# EAGLE design avr_g1000_ctr_24 (EAGLE 9.4.0)
using PC6 as IO Pin requires RSTDSbl Fuse to be set added C2 rmvd AREF swapped PC3, PC6, PD4 08 mirror and totate USB connectors additional FPC ZIF connector abandoned, insufficient real estate
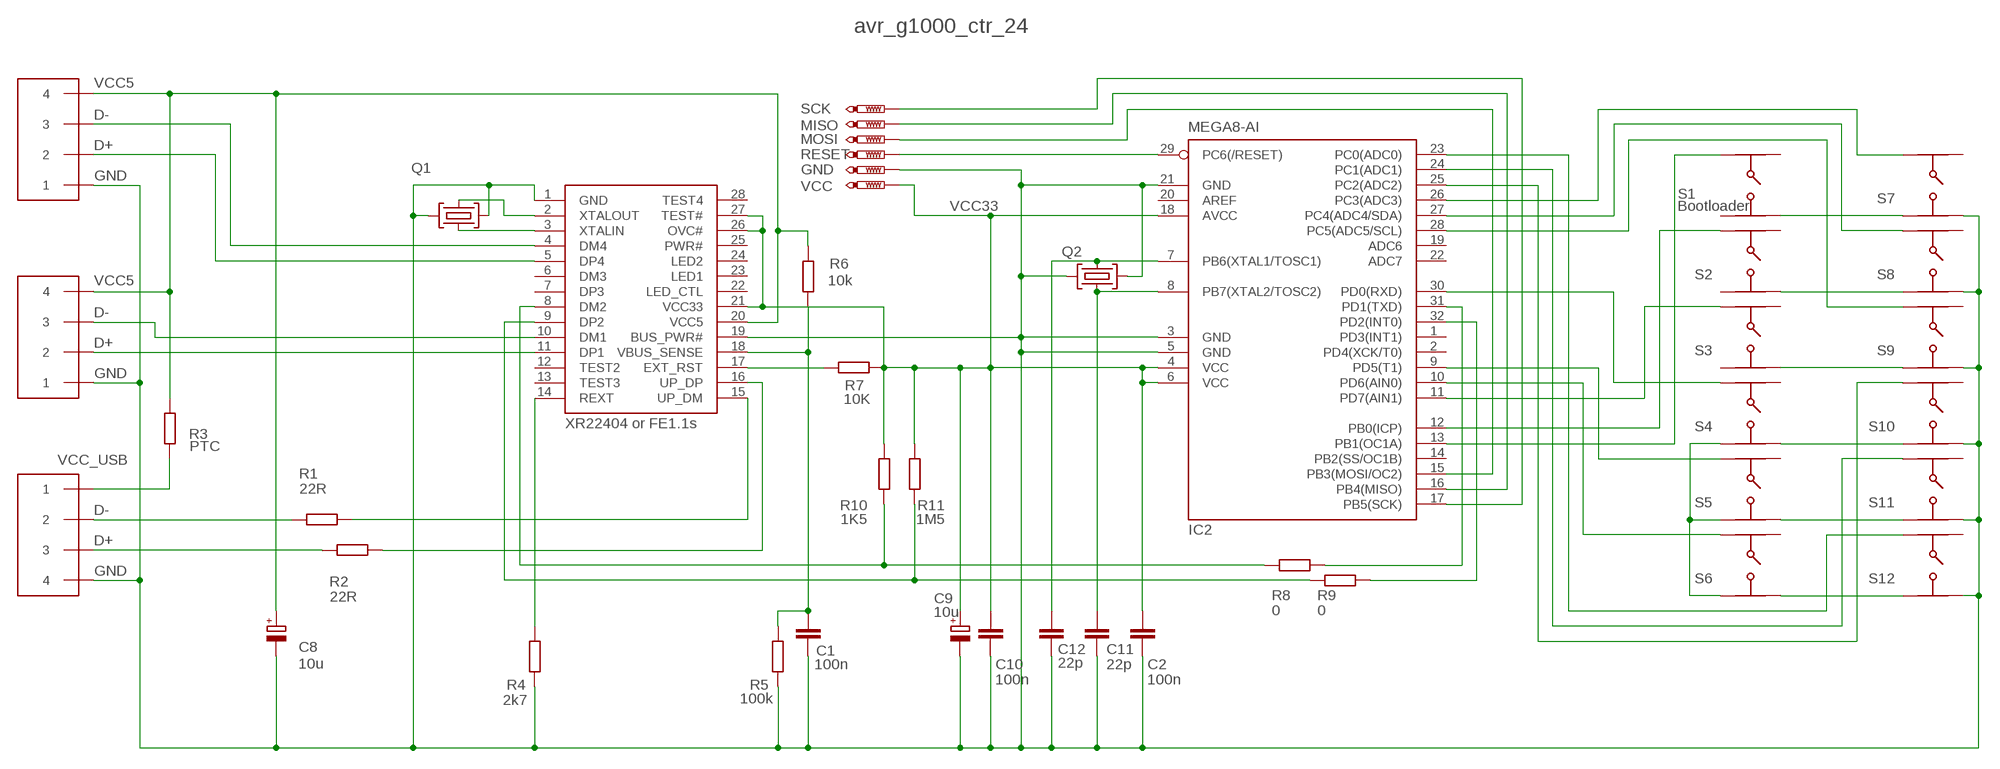
[diagram p0: schematic, sheet 1]

## Parts
C1  100n  C-EUC0402  [C0402]
C2  100n  C-EUC0402  [C0402]
C8  10u  CPOL-EUSMCA  [SMC_A]
C9  10u  CPOL-EUSMCA  [SMC_A]
C10  100n  C-EUC0402  [C0402]
C11  22p  C-EUC0402  [C0402]
C12  22p  C-EUC0402  [C0402]
GND  PTR1TP10R  [TP10R]
IC2  MEGA8-AI  [TQFP32-08]
MISO  PTR1TP10R  [TP10R]
MOSI  PTR1TP10R  [TP10R]
Q1  12MHz  MJ-CRYSTALMJ  [OSCCC500X320X100]
Q2  12Mhz  MJ-CRYSTALMJ  [OSCCC500X320X100]
R1  22R  R-EU_R0603  [R0603]
R2  22R  R-EU_R0603  [R0603]
R3  PTC  R-EU_R0805  [R0805]
R4  2k7  R-EU_R0603  [R0603]
R5  100k  R-EU_R0603  [R0603]
R6  10k  R-EU_R0603  [R0603]
R7  10K  R-EU_R0603  [R0603]
R8  0  R-EU_R0603  [R0603]
R9  0  R-EU_R0603  [R0603]
R10  1K5  R-EU_R0603  [R0603]
R11  1M5  R-EU_R0603  [R0603]
RESET  PTR1TP10R  [TP10R]
S1  B3FS1000  [B3FS1000]
S2  B3FS1000  [B3FS1000]
S3  B3FS1000  [B3FS1000]
S4  B3FS1000  [B3FS1000]
S5  B3FS1000  [B3FS1000]
S6  B3FS1000  [B3FS1000]
S7  B3FS1000  [B3FS1000]
S8  B3FS1000  [B3FS1000]
S9  B3FS1000  [B3FS1000]
S10  B3FS1000  [B3FS1000]
S11  B3FS1000  [B3FS1000]
S12  B3FS1000  [B3FS1000]
SCK  PTR1TP10R  [TP10R]
U$1  HEADER4X1.27  [HEADER4X1.27]
U$2  HEADER4X1.27  [HEADER4X1.27]
U$3  HEADER4X1.27  [HEADER4X1.27]
VCC  PTR1TP10R  [TP10R]
XR22404  XR22404  [XR22404]

## Nets
D+: R2.1 U$1.P3
D-: R1.1 U$1.P2
DM1: U$2.P3 XR22404.10(DM1)
DM2: R8.1 R10.1 XR22404.8(DM2)
DM4: U$3.P3 XR22404.4(DM4)
DP1: U$2.P2 XR22404.11(DP1)
DP2: R9.1 R11.1 XR22404.9(DP2)
DP4: U$3.P2 XR22404.5(DP4)
EXT_RST: R7.1 XR22404.17(EXT_RST)
GND [GND]: C1.2 C2.2 C8.- C9.- C10.2 C11.2 C12.2 GND.TP IC2.3(GND) IC2.5(GND) IC2.21(GND) Q1.2(GND1) Q1.4(GND2) Q2.2(GND1) Q2.4(GND2) R4.1 R5.1 S1.1 S2.1 S3.1 S4.1 S4.2 S5.1 S5.2 S6.1 S6.2 S7.1 S7.2 S8.1 S8.2 S9.1 S9.2 S10.1 S10.2 S11.1 S11.2 S12.1 S12.2 U$1.P4 U$2.P1 U$3.P1 XR22404.1(GND) XR22404.19(BUS_PWR#)
MISO: IC2.16(PB4(MISO)) MISO.TP
MOSI: IC2.15(PB3(MOSI/OC2)) MOSI.TP
PB0: IC2.12(PB0(ICP)) S2.4
PB1: IC2.13(PB1(OC1A)) S1.4
PC0: IC2.23(PC0(ADC0)) S12.4
PC1: IC2.24(PC1(ADC1)) S11.4
PC2: IC2.25(PC2(ADC2)) S10.4
PC3: IC2.26(PC3(ADC3)) S7.4
PC4: IC2.27(PC4(ADC4/SDA)) S8.4
PC5: IC2.28(PC5(ADC5/SCL)) S9.4
PD0: IC2.30(PD0(RXD)) S4.4
PD1: IC2.31(PD1(TXD)) R8.2
PD2: IC2.32(PD2(INT0)) R9.2
PD5: IC2.9(PD5(T1)) S5.4
PD6: IC2.10(PD6(AIN0)) S6.4
PD7: IC2.11(PD7(AIN1)) S3.4
RESET: IC2.29(PC6(/RESET)) RESET.TP
REXT: R4.2 XR22404.14(REXT)
SCK: IC2.17(PB5(SCK)) SCK.TP
UP_DM: R1.2 XR22404.15(UP_DM)
UP_DP: R2.2 XR22404.16(UP_DP)
VBUS_SENSE: C1.1 R5.2 R6.1 XR22404.18(VBUS_SENSE)
VCC5: C8.+ R3.2 R6.2 U$2.P4 U$3.P4 XR22404.20(VCC5)
VCC33: C2.1 C9.+ C10.1 IC2.4(VCC) IC2.6(VCC) IC2.18(AVCC) R7.2 R10.2 R11.2 VCC.TP XR22404.21(VCC33) XR22404.26(OVC#) XR22404.27(TEST#)
VCC_USB: R3.1 U$1.P1
XTAL1: C12.1 IC2.7(PB6(XTAL1/TOSC1)) Q2.1(CRYSTAL1)
XTAL2: C11.1 IC2.8(PB7(XTAL2/TOSC2)) Q2.3(CRYSTAL2)
XTALIN: Q1.3(CRYSTAL2) XR22404.3(XTALIN)
XTALOUT: Q1.1(CRYSTAL1) XR22404.2(XTALOUT)
Unconnected: IC2.1(PD3(INT1)) IC2.2(PD4(XCK/T0)) IC2.14(PB2(SS/OC1B)) IC2.19(ADC6) IC2.20(AREF) IC2.22(ADC7) S1.2 S1.3 S2.2 S2.3 S3.2 S3.3 S4.3 S5.3 S6.3 S7.3 S8.3 S9.3 S10.3 S11.3 S12.3 XR22404.6(DM3) XR22404.7(DP3) XR22404.12(TEST2) XR22404.13(TEST3) XR22404.22(LED_CTL) XR22404.23(LED1) XR22404.24(LED2) XR22404.25(PWR#) XR22404.28(TEST4)

## Notes on the sheet
- avr_g1000_ctr_24
- Bootloader
- XR22404 or FE1.1s

## Library data of the parts
C1 C2 C10-C12 = rcl:C-EU: CAPACITOR, European symbol; SPICEPREFIX: C
C8 C9 = rcl:CPOL-EU: POLARIZED CAPACITOR, European symbol; SPICEPREFIX: C
GND MISO MOSI RESET SCK VCC = testpad:PTR1: TEST PIN
IC2 = atmel:MEGA8: MICROCONTROLLER 8 Kbytes FLASH, 1 kbytes SRAM, 512 bytes EEPROM, USART, 6-channel 10 bit ADC, 2-channel 8 bit ADC Pin compatible with Atmega48, ATMega88, ATMega168 Source: avr.lbr; MPN: ATMEGA8-16AU; OC_FARNELL: 9171371; OC_NEWARK: 73M8863
Q1 Q2 = euroquartz:MJ-CRYSTAL: Miniature size: 5.0mm x 3.2mm x 1.0mm height
R1-R11 = rcl:R-EU_: RESISTOR, European symbol; SPICEPREFIX: R
S1-S12 = omron b3fs1000:B3FS1000
U$1-U$3 = header4x1.27:HEADER4X1.27
XR22404 = xr22404:XR22404

## Net classes
0 default: width 0.15 mm, clearance 0.15 mm
1 GND: width 0.3 mm, clearance 0.15 mm to class 0, clearance 0.15 mm
2 VCC: width 0.3 mm, clearance 0.15 mm to class 0, clearance 0.15 mm to class 1, clearance 0.15 mm

## Board
chgd all 22p and 100n to 0402 v6 dimension filet placement drills and measures v7 position USB conn 08 corrct dimension, realign USB connectors 09 optimizations for case test verify electronic v20 added USB serial and pullup resistors, USB hub ports WIP rearranged S7-12 to avoid use of PC6 v21 testpoints part names cleanup reroute VC33 for RESET pin inlining DRC ok v22 replace tact switches, drill 2mm DRC ok v24 Testpins d 1mm, pitch 1.27 DRC ok
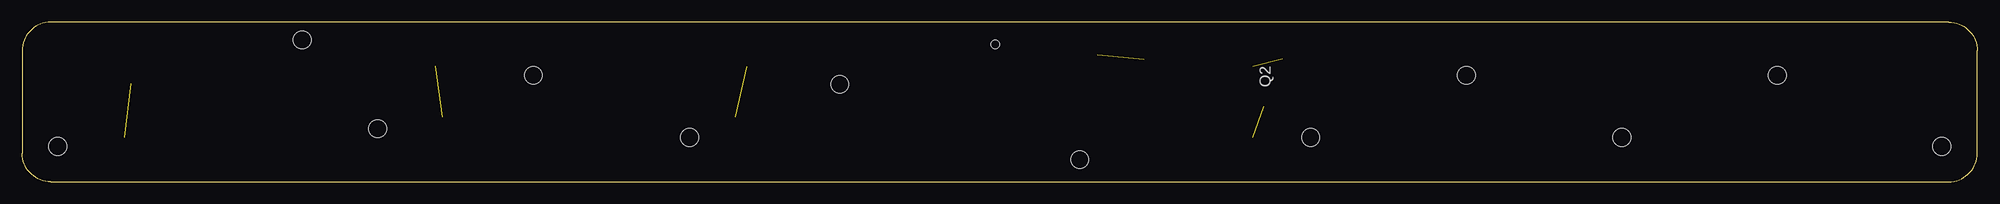
[diagram p1: board, top side]
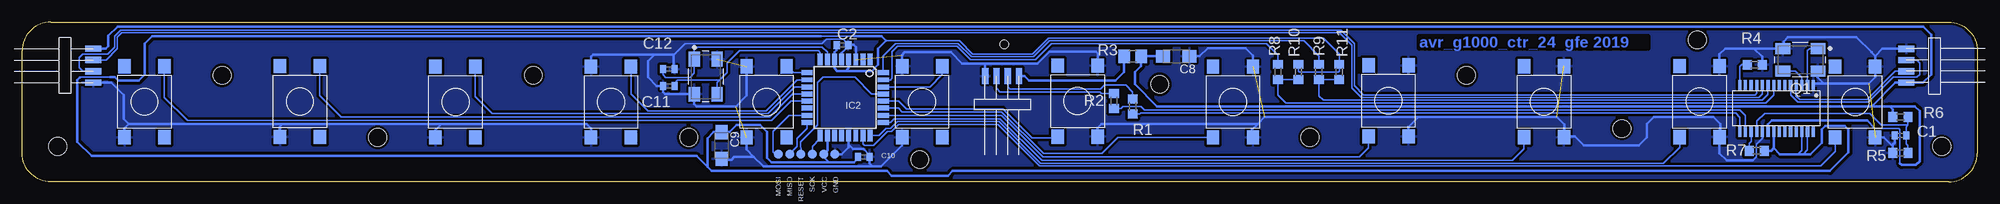
[diagram p2: board, bottom side, seen from below]

Size 220 x 18 mm. Coordinates in mm from the lower left corner, seen from the top.
Outline: 3.2,0 216.8,0 arc90 220,3.2 220,14.8 arc90 216.8,18 3.2,18 arc90 0,14.8 0,3.2 arc90 3.2,0
Copper layers (1*16): Top 0.035mm / dielectric 1.5mm / Bottom 0.035mm
Design rules "default *": minimum track width 6mil, minimum drill 0.35mm, track to track 6mil, track to pad 6mil, pad to pad 6mil, via to via 6mil, smd to smd 6mil, copper to edge 12mil, drill to drill 6mil, minimum pad ring 10mil, minimum via ring 8mil, stop-mask expansion 4mil, vias tented up to drill 0mil, thermal gap 10mil
Holes 2 mm at 92,11 145,5 162.5,12 180,5 197.5,12 216,4 4,4 75.1,5 57.5,12 40,6 31.5,16 119,2.5
Holes 1 mm at 109.5,15.5

### Footprints (pad centres in the part's own frame; a part is rotated, then mirrored left to right if it is on the bottom)
C0402 = smd 0.7 x 0.9: 1 -0.65,0; 2 0.65,0
SMC_A = smd 1.6 x 1.4: + -1.5,0; - 1.5,0
TP10R = smd 1 x 1: TP 0,0
TQFP32-08 = smd 1.27 x 0.559: 1 -4.293,2.8; 2 -4.293,2; 3 -4.293,1.2; 4 -4.293,0.4; 5 -4.293,-0.4; 6 -4.293,-1.2; 7 -4.293,-2; 8 -4.293,-2.8; 17 4.293,-2.8; 18 4.293,-2; 19 4.293,-1.2; 20 4.293,-0.4; 21 4.293,0.4; 22 4.293,1.2; 23 4.293,2; 24 4.293,2.8 | smd 0.559 x 1.27: 9 -2.8,-4.293; 10 -2,-4.293; 11 -1.2,-4.293; 12 -0.4,-4.293; 13 0.4,-4.293; 14 1.2,-4.293; 15 2,-4.293; 16 2.8,-4.293; 25 2.8,4.293; 26 2,4.293; 27 1.2,4.293; 28 0.4,4.293; 29 -0.4,4.293; 30 -1.2,4.293; 31 -2,4.293; 32 -2.8,4.293
OSCCC500X320X100 = smd 1.662 x 1.262: 1 -1.975,-1.275; 2 1.975,-1.275; 3 1.975,1.275; 4 -1.975,1.275
R0603 = smd 1 x 1.1: 1 -0.85,0; 2 0.85,0
R0805 = smd 1.3 x 1.5: 1 -0.95,0; 2 0.95,0
B3FS1000 = smd 1.6 x 1.4: 1 -4,2.25; 2 4,2.25; 3 -4,-2.25; 4 4,-2.25
HEADER4X1.27 = smd 1.803 x 0.711: P1 0,0; P2 0,1.27; P3 0,2.54; P4 0,3.81
XR22404 = smd 0.356 x 1.27: 1 -3.785,-2.502; 2 -3.15,-2.502; 3 -2.515,-2.502; 4 -1.88,-2.502; 5 -1.245,-2.502; 6 -0.61,-2.502; 7 0.025,-2.502; 8 0.66,-2.502; 9 1.295,-2.502; 10 1.93,-2.502; 11 2.565,-2.502; 12 3.2,-2.502; 13 3.835,-2.502; 14 4.47,-2.502; 15 4.47,2.68; 16 3.835,2.68; 17 3.2,2.68; 18 2.565,2.68; 19 1.93,2.68; 20 1.295,2.68; 21 0.66,2.68; 22 0.025,2.68; 23 -0.61,2.68; 24 -1.245,2.68; 25 -1.88,2.68; 26 -2.515,2.68; 27 -3.15,2.68; 28 -3.785,2.68

### Placement (x,y rotation side)
C1  8.65,5.25 180 bottom
C2  127.7,15.4 0 bottom
C8  90.15,14.15 0 bottom
C9  141.3,4.1 270 bottom
C10  125.3,2.8 0 bottom
C11  147.25,10.8 180 bottom
C12  147.25,12.7 0 bottom
GND  128.55,3.1 270 bottom
IC2  127.4,9.5 270 bottom
MISO  133.63,3.1 270 bottom
MOSI  134.9,3.1 270 bottom
Q1  19.9,13.75 180 bottom
Q2  143.1,11.85 270 bottom
R1  95.05,8.5 270 bottom
R2  97.15,9.1 270 bottom
R3  95.05,14.15 0 bottom
R4  25.05,13.2 180 bottom
R5  8.65,3.25 0 bottom
R6  8.65,7.3 180 bottom
R7  24.8,3.5 0 bottom
R8  78.7,12.4 90 bottom
R9  74.1,12.4 90 bottom
R10  76.4,12.4 90 bottom
R11  71.8,12.4 90 bottom
RESET  132.36,3.1 270 bottom
S1  206.24,9.02 90 bottom
S2  188.74,9.06 90 bottom
S3  171.24,9 90 bottom
S4  118.74,9.02 90 bottom
S5  136.24,9.01 90 bottom
S6  153.74,9 90 bottom
S7  66.26,9.13 270 bottom
S8  83.76,8.99 270 bottom
S9  101.24,9.1 270 bottom
S10  48.76,9.03 270 bottom
S11  31.26,9.04 270 bottom
S12  13.74,9 270 bottom
SCK  131.09,3.1 270 bottom
U$1  107.83,11.9 90 bottom
U$2  212,11.2 0 bottom
U$3  8,15 180 bottom
VCC  129.82,3.1 270 bottom
XR22404  22.25,8.36 180 bottom

### Tracks (layer width: path | path; a pad name or v marks a point on that pad's centre or on a via)
D+
  Bottom 0.152: U$1.P3 110.37,10.57 109.95,10.15 98.75,10.15 98.55,9.95 R2.1
D-
  Bottom 0.152: R1.1 95.05,10.15 95.8,10.9 98.2,10.9 98.64,10.46 108.86,10.46 109.1,10.7 U$1.P2
DM1
  Bottom 0.152: XR22404.10 24.18,9.92 24.59,9.51 69.31,9.51 70.4,10.6 70.4,15.4 71.8,16.8 208.8,16.8 209.3,16.3 209.3,15 210.56,13.74 U$2.P3
DM2
  Bottom 0.152: XR22404.8 22.91,9.79 23.82,8.88 77.78,8.88 78.7,9.8 78.7,11.5 | R8.1 78.7,11.5 | R10.1 78.65,11.55 78.7,11.5
DM4
  Bottom 0.152: XR22404.4 20.4,10.83 20.4,9.7 20,9.3 12.4,9.3 9.24,12.46 U$3.P3
DP1
  Bottom 0.152: XR22404.11 24.82,9.99 25,9.81 69.08,9.81 70.09,10.83 70.09,15.6 71.61,17.11 208.93,17.11 209.6,16.43 209.6,15.2 210.41,14.4 213.2,14.4 213.6,14 213.6,12.9 213.17,12.47 U$2.P2
DP2
  Bottom 0.152: XR22404.9 23.55,9.86 24.2,9.2 73.6,9.2 74.1,9.7 R9.1 R11.1
DP4
  Bottom 0.152: XR22404.5 21,9.8 20.2,8.99 12.27,8.99 9.47,11.8 6.8,11.8 6.5,12.1 6.5,13.4 6.83,13.73 U$3.P2
EXT_RST
  Bottom 0.152: XR22404.17 25.45,4.55 25.65,4.35 R7.1
GND  (6 unrouted)
  Bottom 0.15: 25.27,2.4 24.85,2.83 24.85,4.21 24.14,4.92 24.14,5.63 XR22404.19
  Bottom 0.152: 146.7,14.3 145.4,15.6 130,15.6 129.5,16.1 127.57,16.1 127.08,15.44 C2.2 | S11.2 28.9,4.8 | 98.97,6.07 99,6.1 | 46.5,13.19 S10.1 | 21.8,15.1 Q1.2
  Bottom 0.3: 11.47,14.15 11.92,14.6 11.9,14.6 13.6,16.3 21.3,16.3 21.8,15.8 21.8,15.1 | 172.8,6.5 156.5,6.5 155.99,5.99 S6.1 | 172.8,6.5 173.51,5.79 173.49,5.78 S3.1 | 172.8,6.5 190.7,6.5 | 190.7,6.5 191.01,6.19 191.01,5.08 S2.1 | 190.7,6.5 208,6.5 | S4.1 121.01,4.09 123.37,1.73 124.3,1.73 136.58,1.73 137.68,2.83 | 137.68,2.83 138.51,3.66 138.51,4.99 S5.1 | 124.55,2.9 C10.2 124.6,2.95 | 148.85,14.35 149.6,13.6 149.6,11.8 148.6,10.8 C11.2 147.9,10.1 147.68,9.88 Q2.2 144.38,8.78 144.1,8.51 139.7,8.51 138.49,9.71 S5.2 | 148.85,14.35 146.7,14.35 146.7,14.3 146.7,12.8 C12.2 | 25.12,15.03 28.36,15.03 29.01,14.38 S11.1 | 28.9,5 28.9,4.8 | 62.9,7.3 47.3,7.3 46.49,6.49 46.49,5.05 | S7.2 63.99,6.21 62.9,7.3 | 62.9,7.3 80.2,7.3 80.95,6.55 | 80.95,6.55 81.6,5.9 81.6,5.08 S8.2 | 80.95,6.55 98.55,6.55 99,6.1 S9.2 | 148.85,14.35 155.75,14.35 156.01,14.09 S6.2 | C8.- 87.55,14.15 86.6,15.1 82.35,15.1 81.49,14.24 81.49,13.01 S8.1 | 11.47,14.15 11.47,14.2 10.66,15.01 U$3.P1 | U$2.P1 210,11.2 208.6,9.8 208.6,7.1 208,6.5 | U$1.P4 111.64,13.34 | 111.64,13.34 114.24,13.34 115.5,14.6 120.7,14.6 121.01,14.29 121.01,13.04 S4.2 | 111.64,13.34 105.76,13.34 104.4,14.7 99.2,14.7 98.97,14.47 98.97,13.12 S9.1 | IC2.3 126.2,15.2 126.44,15.44 127.08,15.44 | IC2.5 127.8,14.5 127.05,15.25 C2.2 | R5.1 9.5,4 | 9.5,4 9.5,4.2 9.3,4.4 C1.2 | Q1.2 25.12,15.03 | R4.1 24.2,14.1 25.12,15.03 | 17.3,11.1 18,11.8 17.93,11.88 Q1.4 | 17.3,11.1 12.2,11.1 11.47,11.83 11.47,12.98 | XR22404.1 18.23,11.1 17.3,11.1 | 137.68,2.83 139.87,2.83 140.2,2.5 141.2,2.5 C9.- | 29,4.9 28.9,5 | 208,6.5 208.5,6 S1.1 | S12.2 10.5,5 9.5,4 | 11.47,12.98 S12.1 | 11.47,14.15 11.47,12.98
  Bottom 0.3: 28.9,5 28.9,6.5 29.7,7.3 36.4,7.3 37.2,6.5 37.2,5 38.1,4.1 44.3,4.1 45.3,5.1 46.44,5.1 46.49,5.05 | 25.27,2.4 28.2,2.4 29.01,3.21 S11.2 | 46.49,5.05 S10.2
  Bottom 0.305: C10.2 124.65,2.08 124.3,1.73 | IC2.21 127,4.2 | 127,4.2 126.5,3.7 125.35,3.7 124.6,2.95 | GND.TP 127.8,3.1 127,3.9 127,4.2
  pour Bottom (isolate 0.3): -1.5,18.6 222.6,18.6 222.6,-2.3 -1.5,-2.3
MISO
  Bottom 0.152: IC2.16 131.69,6 132.8,4.89 132.8,4 133.2,3.6 MISO.TP
MOSI
  Bottom 0.152: MOSI.TP 135.2,3.1 135.5,3.4 135.5,5.7 133.7,7.5 IC2.15
PB0
  Bottom 0.152: IC2.12 133.29,9.9 135.89,7.3 184.1,7.3 186.51,9.71 186.51,13.04 S2.4
PB1
  Bottom 0.152: IC2.13 133.49,9.1 135.69,6.9 201.4,6.9 204.01,9.51 204.01,13 S1.4
PC0
  Bottom 0.152: IC2.23 125.4,4.3 125.2,4.1 124.2,4.1 122.61,5.7 122.17,5.7 121.38,6.49 110.22,6.49 105.52,1.79 17.64,1.79 15.97,3.45 S12.4
PC1
  Bottom 0.152: IC2.24 123.59,5.21 122.8,6 122.3,6 121.5,6.79 110.09,6.79 105.39,2.1 35.3,2.1 33.5,3.9 S11.4
PC2
  Bottom 0.152: IC2.25 122.3,6.7 121.9,7.1 109.96,7.1 105.26,2.4 52.3,2.4 51,3.7 S10.4
PC3
  Bottom 0.152: IC2.26 109.83,7.5 105.13,2.79 69.5,2.79 68.5,3.8 S7.4
PC4
  Bottom 0.152: IC2.27 121.4,8.3 121,7.89 109.8,7.89 105.1,3.2 98.5,3.2 96.71,4.99 S8.4
PC5
  Bottom 0.152: S9.4 103.57,4.85 103.67,4.95 106.37,4.95 109.62,8.2 120.5,8.2 121.4,9.1 IC2.28
PD0
  Bottom 0.152: S4.4 116.51,12.07 117.87,10.7 IC2.30
PD1
  Bottom 0.152: IC2.31 122.3,11.5 122.1,11.7 122.1,14.7 121.51,15.29 114.8,15.29 113.31,13.8 105.99,13.8 104.2,15.59 79.99,15.59 78.7,14.3 R8.2
PD2
  Bottom 0.152: IC2.32 123.11,14.19 121.7,15.6 114.67,15.6 113.19,14.11 106.18,14.11 104.4,15.89 75.8,15.89 74.1,14.2 R9.2
PD5
  Bottom 0.152: IC2.9 133.19,12.3 134.01,13.11 S5.4
PD6
  Bottom 0.152: IC2.10 132.8,11.5 136.3,8 149.6,8 151.51,9.91 151.51,12.98 S6.4
PD7
  Bottom 0.152: IC2.11 133.07,10.7 136.07,7.7 167.1,7.7 169.01,9.6 169.01,12.98 S3.4
RESET
  Bottom 0.152: IC2.29 124.41,9.9 126.31,11.8 129.9,11.8 130.5,11.2 130.5,6.4 132.4,4.5 132.36,3.2 RESET.TP
REXT
  Bottom 0.152: R4.2 26.5,13.2 26.72,12.98 XR22404.14
SCK
  Bottom 0.152: SCK.TP 131.09,4.01 130.29,4.81 130.29,5.12 IC2.17
UP_DM
  Bottom 0.152: XR22404.15 26.72,7.28 27.2,7.76 94.14,7.76 94.25,7.65 R1.2
UP_DP
  Bottom 0.152: XR22404.16 26.09,7.49 26.7,8.1 93.73,8.1 94.11,8.48 96.12,8.48 96.35,8.25 R2.2
VBUS_SENSE
  Bottom 0.152: XR22404.18 24.79,5.71 24.79,6.85 23.93,7.7 12.1,7.7 10.8,6.4 7.8,6.4 | R5.2 7.8,4.1 8,4.3 C1.1 8,6.2 7.8,6.4 | R6.1 7.8,6.4
VCC5
  Bottom 0.15: 11.53,6.03 12.4,6.9 | 8.7,2.1 8.7,5.9 8.83,6.03
  Bottom 0.152: 8.83,6.03 11.53,6.03
  Bottom 0.3: 12.4,6.9 23.1,6.9 23.55,6.46 XR22404.20 | C8.+ R3.2 94.1,13.05 94.8,12.35 94.8,11 92.31,8.51 11.9,8.51 | 11.9,8.51 9.21,11.19 U$3.P4 6.11,11.19 5.2,12.1 5.2,16.6 6.1,17.5 209.27,17.5 210.3,16.47 210.3,15.3 210.6,15 U$2.P4 | 9.85,8.51 7.04,8.51 6.5,7.97 6.5,2.3 6.9,1.9 8.5,1.9 8.7,2.1 | 11.9,8.51 9.85,8.51 | R6.2 9.5,8.16 9.85,8.51
VCC33
  Bottom 0.152: R10.2 76.4,12.5 76.3,12.4 71.9,12.4 71.8,12.5 R11.2 71.8,14.4 73.6,16.2 104.53,16.2 106.31,14.42 113.06,14.42 114.55,15.9 122.8,15.9 | XR22404.26 19.73,3.56 20.2,3.1 | XR22404.27 19.1,3.6 19.6,3.1 | 130.1,16.42 126.4,16.42 | 213.54,11.74 213.49,11.8 210.1,11.8
  Bottom 0.3: 127.3,12.5 127,12.8 IC2.4 | 127.3,12.5 128.3,12.5 128.6,12.8 IC2.6 128.6,14.6 128.35,14.85 C2.1 | 127.3,12.5 124.4,12.5 123.7,13.2 123.7,15 122.8,15.9 123.32,16.42 126.4,16.42 | 128.9,2.2 129.2,2.2 135.7,2.2 136.2,2.7 136.2,5.6 137,6.4 139.6,6.4 140.4,5.6 C9.+ 142.2,5.6 142.9,4.9 142.9,1.7 | 142.9,1.7 142.42,1.22 122.7,1.22 122.18,0.7 115.82,0.7 115.3,1.22 16.58,1.22 14.5,3.3 14.5,5.9 14.9,6.3 17.1,6.3 17.5,5.9 17.5,4.4 18.8,3.1 19.6,3.1 20.2,3.1 22.2,3.1 22.9,3.8 | XR22404.21 22.91,3.81 22.9,3.8 | R7.2 23.2,3.5 22.9,3.8 | 142.9,1.7 144.1,2.9 212.2,2.9 213.8,4.5 213.8,11.48 213.54,11.74 | 130.1,16.42 205.38,16.42 206.2,15.6 206.2,12.1 206.9,11.4 209.2,11.4 209.6,11.8 210.1,11.8
  Bottom 0.305: 128.9,2.2 126.4,2.2 126,2.6 126,2.75 C10.1 | 129.2,2.2 129.82,2.82 VCC.TP 129.4,3.52 IC2.18
VCC_USB
  Bottom 0.3: R3.1 96,12.4 97,11.4 106.7,11.4 107.2,11.9 U$1.P1
XTAL1
  Bottom 0.152: IC2.7 129.4,14.6 129.97,15.17 144.03,15.17 144.38,14.82 Q2.1 144.38,12.28 144.88,11.78 147.6,11.78 147.9,12.07 C12.1
XTAL2
  Bottom 0.152: IC2.8 130.2,14.59 130.4,14.79 139.31,14.79 140.7,13.4 140.7,12.3 141.53,11.47 | 141.53,11.47 146.23,11.47 146.6,11.1 C11.1 | Q2.3 141.82,11.18 141.53,11.47
XTALIN
  Bottom 0.152: XR22404.3 19.73,11.73 20.5,12.5 21.85,12.5 Q1.3
XTALOUT
  Bottom 0.152: XR22404.2 19.1,14.8 18.88,15.03 Q1.1

### Text on the board
Bottom: avr_g1000_ctr_24 gfe 2019